# Altium project PCB_Project_ESP32.PrjPcb
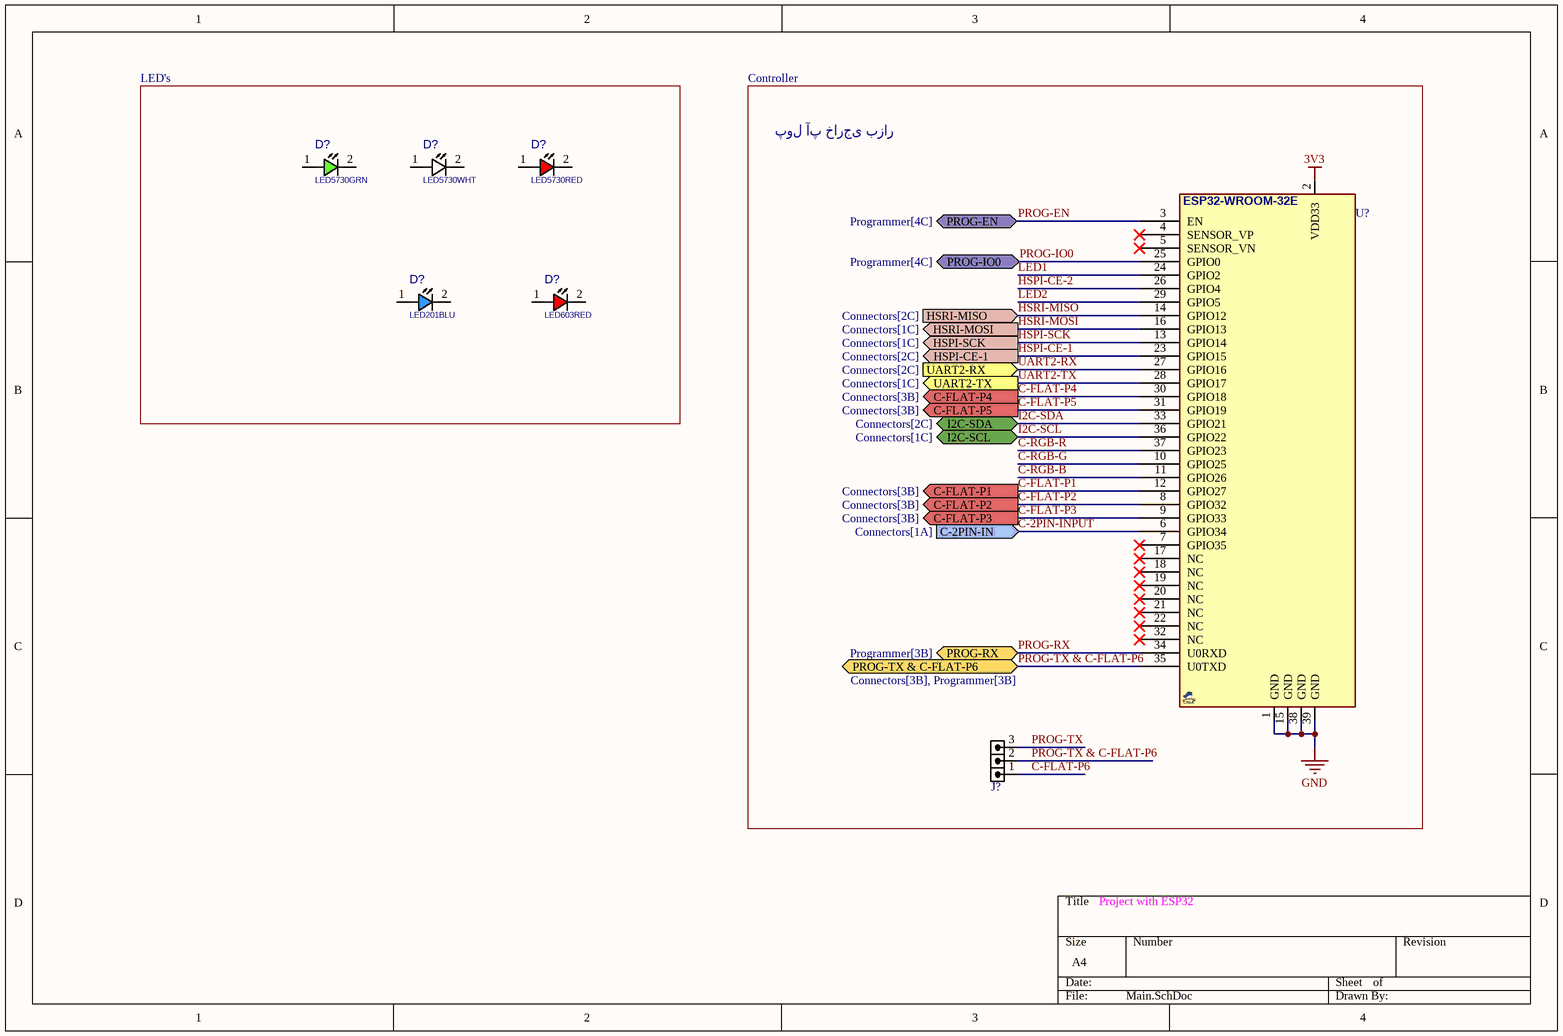
[diagram p0: Main.SchDoc]
5 sheets, 31 parts. Net scope: flat (ports and power ports of the same name join across sheets).
Board file: PCB1.PcbDoc
Sheets:
  Main.SchDoc
  ETH-W5500.SchDoc
  Power.SchDoc
  Programmer.SchDoc
  Connectors.SchDoc

## Sheet Main.SchDoc
size A4; SheetNumber: 1; SheetTotal: 5

### Parts
(Parts that share a designator on the sheet are numbered #1, #2 ... from top to bottom, then left to right.)
D?#1  LED5730GRN  [LED5730]
D?#2  LED5730WHT  [LED5730]
D?#3  LED5730RED  [LED5730]
D?#4  LED201BLU  [LED0201BLU]
D?#5  LED603RED  [LED0603RED]
J?#1  HDRM3  [HDR_M_1X3]  (value not drawn)
U?#1  ESP32-WROOM-32E  [ESP32S]  (value not drawn)

### Blocks framed on the sheet
LED's: D?#1-D?#5
پول آپ خارجی بزار: J?#1 U?#1

### Ports
C-2PIN-IN (in, see Connectors[1A]), C-FLAT-P1 (out, see Connectors[3B]), C-FLAT-P2 (out, see Connectors[3B]), C-FLAT-P3 (out, see Connectors[3B]), C-FLAT-P4 (out, see Connectors[3B]), C-FLAT-P5 (out, see Connectors[3B]), HSPI-CE-1 (out, see Connectors[2C]), HSPI-SCK (out, see Connectors[1C]), HSRI-MISO (in, see Connectors[2C]), HSRI-MOSI (out, see Connectors[1C]), I2C-SCL (bidir, see Connectors[1C]), I2C-SDA (bidir, see Connectors[2C]), PROG-EN (bidir, see Programmer[4C]), PROG-IO0 (bidir, see Programmer[4C]), PROG-RX (bidir, see Programmer[3B]), PROG-TX & C-FLAT-P6 (bidir, see Connectors[3B], Programmer[3B]), UART2-RX (in, see Connectors[2C]), UART2-TX (out, see Connectors[1C])

### Nets
3V3: U?#1.2(VDD33)
GND: U?#1.1(GND) U?#1.15(GND) U?#1.38(GND) U?#1.39(GND)
C-FLAT-P1: U?#1.12(GPIO27) ; port C-FLAT-P1
C-FLAT-P2: U?#1.8(GPIO32) ; port C-FLAT-P2
C-FLAT-P3: U?#1.9(GPIO33) ; port C-FLAT-P3
C-FLAT-P4: U?#1.30(GPIO18) ; port C-FLAT-P4
C-FLAT-P5: U?#1.31(GPIO19) ; port C-FLAT-P5
C-FLAT-P6: J?#1.1
C-RGB-B: U?#1.11(GPIO26)
C-RGB-G: U?#1.10(GPIO25)
C-RGB-R: U?#1.37(GPIO23)
HSPI-CE-1: U?#1.23(GPIO15) ; port HSPI-CE-1
HSPI-CE-2: U?#1.26(GPIO4)
HSPI-SCK: U?#1.13(GPIO14) ; port HSPI-SCK
HSRI-MISO: U?#1.14(GPIO12) ; port HSRI-MISO
HSRI-MOSI: U?#1.16(GPIO13) ; port HSRI-MOSI
I2C-SCL: U?#1.36(GPIO22) ; port I2C-SCL
I2C-SDA: U?#1.33(GPIO21) ; port I2C-SDA
LED1: U?#1.24(GPIO2)
LED2: U?#1.29(GPIO5)
PROG-EN: U?#1.3(EN) ; port PROG-EN
PROG-IO0: U?#1.25(GPIO0) ; port PROG-IO0
PROG-RX: U?#1.34(U0RXD) ; port PROG-RX
PROG-TX: J?#1.3
PROG-TX & C-FLAT-P6: J?#1.2 U?#1.35(U0TXD) ; port PROG-TX & C-FLAT-P6
UART2-RX: U?#1.27(GPIO16) ; port UART2-RX
UART2-TX: U?#1.28(GPIO17) ; port UART2-TX
NetJ-2PIN_1: U?#1.6(GPIO34) ; port C-2PIN-IN

Not connected (* = marked no-connect by the designer): D?#1 1(ANODE) 2(CATHODE); D?#2 1(ANODE) 2(CATHODE); D?#3 1(ANODE) 2(CATHODE); D?#4 1(ANODE) 2(CATHODE); D?#5 1(ANODE) 2(CATHODE); U?#1 4(SENSOR_VP)* 5(SENSOR_VN)* 7(GPIO35)* 17(NC)* 18(NC)* 19(NC)* 20(NC)* 21(NC)* 22(NC)* 32(NC)*

### Notes on the sheet
- Controller
- Project with ESP32
- Labels drawn without touching a wire or pin: C-2PIN-INPUT

### Library data of the parts
D?#1 = LED_SMD_5730GRN: LED, SMD, 5730 GREEN; MANF: CHINA; DESC: DESCRIPTION; MANF_P#: GBG-5730TGKT; PARAM2: 2.2V; ASSEMBLY: ASSEMBLY; PRICE: 50@Javan; VALUE: LED5730GRN
D?#2 = LED_SMD_5730WHT: LED, SMD, 5730 WHITE; DESC: DESCRIPTION; MANF_P#: MANF_PART#; PARAM2: 2.2V; MANF: MANF; ASSEMBLY: ASSEMBLY; PRICE: 50t@Javan; VALUE: LED5730WHT
D?#3 = LED_SMD_5730RED: LED, SMD, 5730 RED; MANF: CHINA; DESC: DESCRIPTION; PARAM2: 2.2V; ASSEMBLY: ASSEMBLY; PRICE: 50@Javan; VALUE: LED5730RED
D?#4 = LED_SMD_0201_BLU: LED, SMD, 0201, BLUE; PARAM: 5mA, 470nm, 110° Angle; MANF: Lumex; DESC: DESCRIPTION; MANF_P#: SML-LX0201USBC-TR; PARAM2: 2.6V, -40~85°C; ASSEMBLY: ASSEMBLY; PRICE: 0.3$; VALUE: LED201BLU
D?#5 = LED_SMD_0603_RED: LED, SMD, 0603, RED; PARAM: 30mA, 640nm; DESC: DESCRIPTION; MANF_P#: MANF_PART#; PARAM2: 1.8~2.5V; MANF: MANF; ASSEMBLY: ASSEMBLY; PRICE: PRICE; VALUE: LED603RED
J?#1 = HDR_M_1X3: CONN, HEADER, Male, pitch: 2.54mm, 3POS; VALUE: HDRM3
U?#1 = ESP32-WROOM-32E: WiFi with Bluetooth 4.0; MANF_P#: ESP32-WROOM-32E; VALUE: ESP32-WROOM-32E

## Sheet ETH-W5500.SchDoc
size A4; SheetNumber: 2; SheetTotal: 5
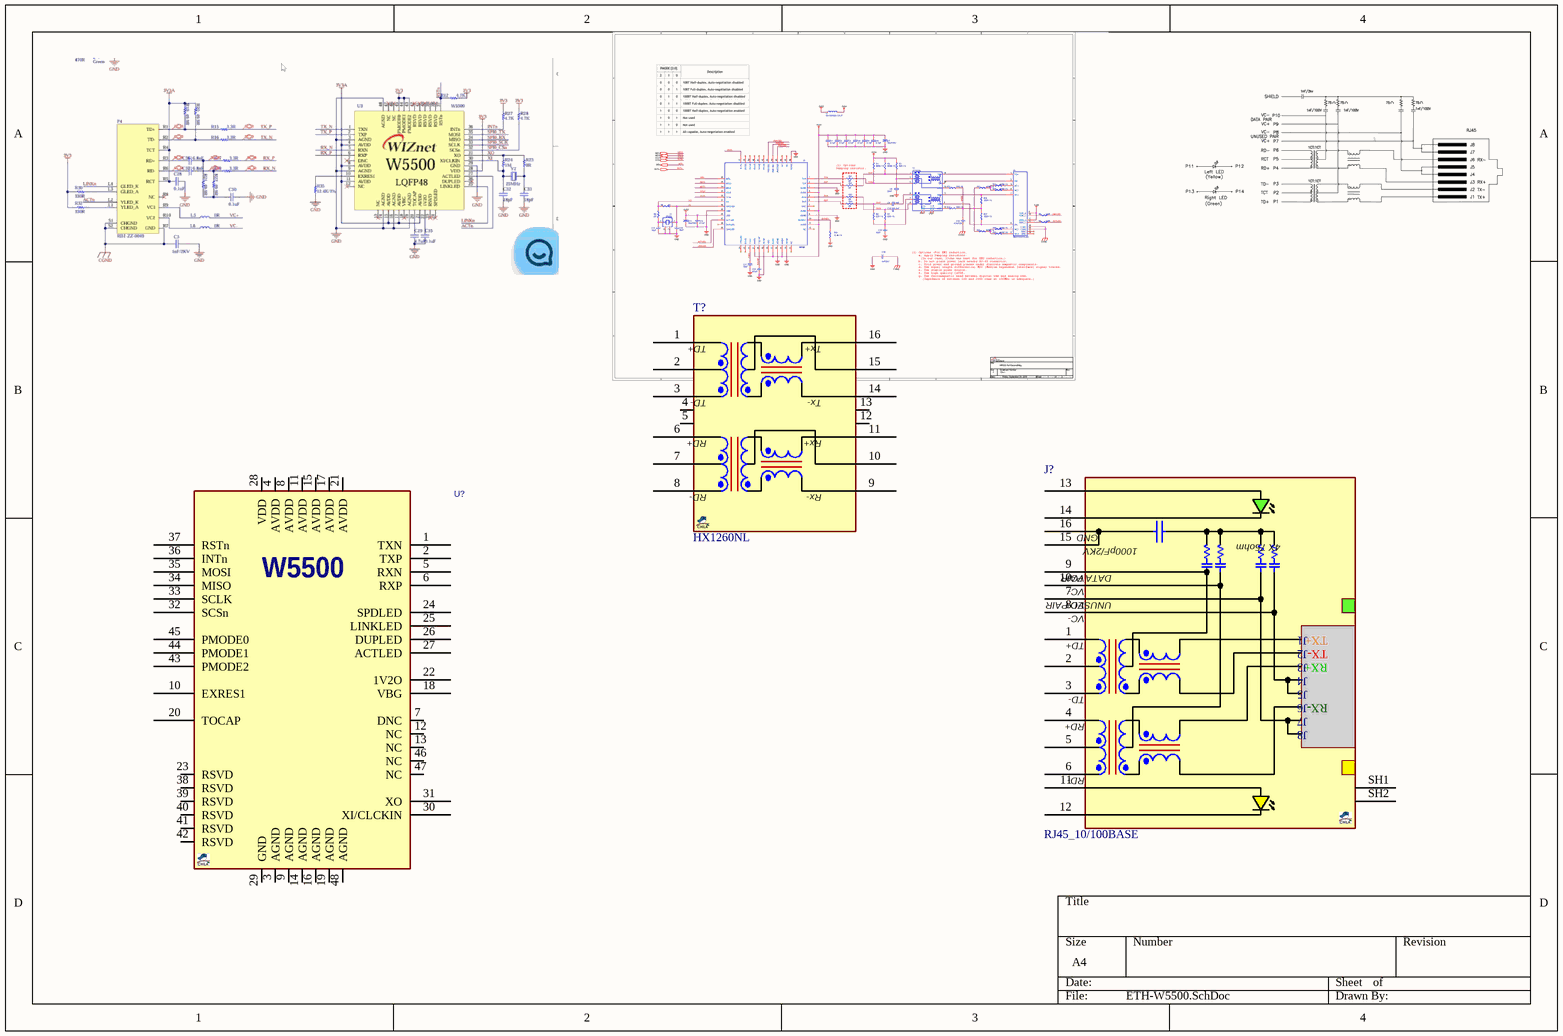
[diagram p1: ETH-W5500.SchDoc]

### Parts
(Parts that share a designator on the sheet are numbered #1, #2 ... from top to bottom, then left to right.)
J?#2  RJ45_10/100BASE  [RJ45_10M_RJ000002]
T?  HX1260NL  [SO_16_7W6H]
U?#2  (no value)  [QFG50_48]

### Nets

Not connected (* = marked no-connect by the designer): J?#2 1(TD+) 2(TCT) 3(TD-) 4(RD+) 5(RCT) 6(RD-) 7(VCU+) 8(VCU-) 9(VCD+) 10(VCD-) 11(YLED+) 12(YLED-) 13(GLED+) 14(GLED-) 15(P15) 16(CHSGND) SH1 SH2; T? 1(TD+) 2(CTD) 3(TD-) 4(NC_1) 5(NC_2) 6(RD+) 7(CRD) 8(RD-) 9(RX-) 10(CRX) 11(RX+) 12(NC_3) 13(NC_4) 14(TX-) 15(CTX) 16(TX+); U?#2 1(TXN) 2(TXP) 3(AGND) 4(AVDD) 5(RXN) 6(RXP) 7(DNC) 8(AVDD) 9(AGND) 10(EXRES1) 11(AVDD) 12(NC) 13(NC) 14(AGND) 15(AVDD) 16(AGND) 17(AVDD) 18(VBG) 19(AGND) 20(TOCAP) 21(AVDD) 22(1V2O) 23(RSVD) 24(SPDLED) 25(LINKLED) 26(DUPLED) 27(ACTLED) 28(VDD) 29(GND) 30(XI/CLCKIN) 31(XO) 32(SCSn) 33(SCLK) 34(MISO) 35(MOSI) 36(INTn) 37(RSTn) 38(RSVD) 39(RSVD) 40(RSVD) 41(RSVD) 42(RSVD) 43(PMODE2) 44(PMODE1) 45(PMODE0) 46(NC) 47(NC) 48(AGND)

### Notes on the sheet
- (in symbol HX1260NL_SO16) Tx+; Tx-; Rx+; Rx-
- (in symbol RJ45_RJ000002) GND; 4X 75ohm; 1000pF/2KV; VC+; DATA PAIR; VC-; UNUSED PAIR; J1; TX+; J2; TX-; J3; RX+; J4; J5; J6; RX-; J7; J8

### Library data of the parts
J?#2 = RJ45_RJ000002: RJ45, 10/100BASE, G/Y LED; MANF: LINK-PP, YCL; MANF_P#: RJ000002; PARAM2: 10/100BASE, G/Y LED; VALUE: RJ45_10/100BASE
T? = HX1260NL_SO16: Transformer, LAN, 100 Base-T , 1CT:1CT, 350uH; MANF: Pulse; PARAM2: 1CT:1CT, 350uH, 0~70°C; MANF_P#: HX1260NL; PARAM: LAN, 100 Base-T; PRICE: 4.5$; VALUE: HX1260NL
U?#2 = W5500_QFP48: Ethernet Controller, 10/100, SPI, DMA; MANF: WIZNET; MANF_P#: W5500

## Sheet Power.SchDoc
size A4; SheetNumber: 3; SheetTotal: 5
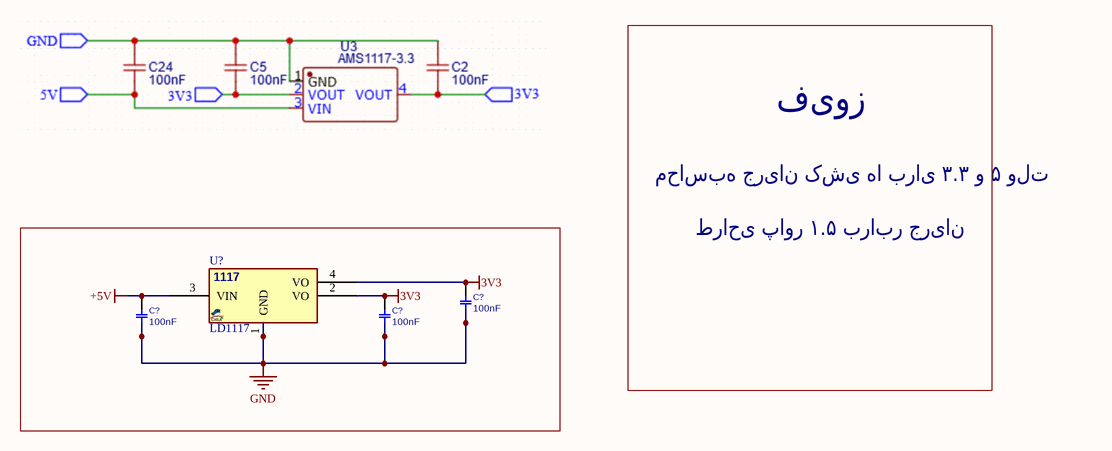
[diagram p2: Power.SchDoc]

### Parts
(Parts that share a designator on the sheet are numbered #1, #2 ... from top to bottom, then left to right.)
C?#1  100nF  [C0402]
C?#2  100nF  [C0402]
C?#3  100nF  [C0402]
U?#3  LD1117  [SOT223_4]

### Nets
3V3: C?#1.1 C?#3.1 U?#3.2(VO) U?#3.4(VO)
+5V: C?#2.1 U?#3.3(VIN)
GND: C?#1.2 C?#2.2 C?#3.2 U?#3.1(GND)

### Notes on the sheet
- فیوز
- محاسبه جریان کشی ها برای ۳.۳ و ۵ ولت
- طراحی پاور ۱.۵ برابر جریان
- (in symbol VREG_1117_SOT223) 1117

### Library data of the parts
C?#1-C?#3 = CAP_SMD_MLCC: CAP, MLCC; PARAM: C0G, 10%; DESC: CAP, MLCC, 1nF, 50V, C0G, 10%, 0402; MANF_P#: MANF_PART#; MANF: Murata; PARAM2: 50V; PRICE: 100= 1$; ASSEMBLY: ASSEMBLY; VALUE: 100nF
U?#3 = VREG_1117_SOT223: REG, Linear, LDO1V, 0.8A, SOT-223; MANF_P#: LD1117, LM1117, AMS1117, TLV1117, REG1117, NCP1117, LT1117, SPX1117; MANF: TI, ON, ST; PARAM2: 1.2/1.5/1.8/2.5/2.85/3.3/5V; PARAM: LDO1V, 0.8A; VALUE: LD1117

## Sheet Programmer.SchDoc
size A4; SheetNumber: 4; SheetTotal: 5
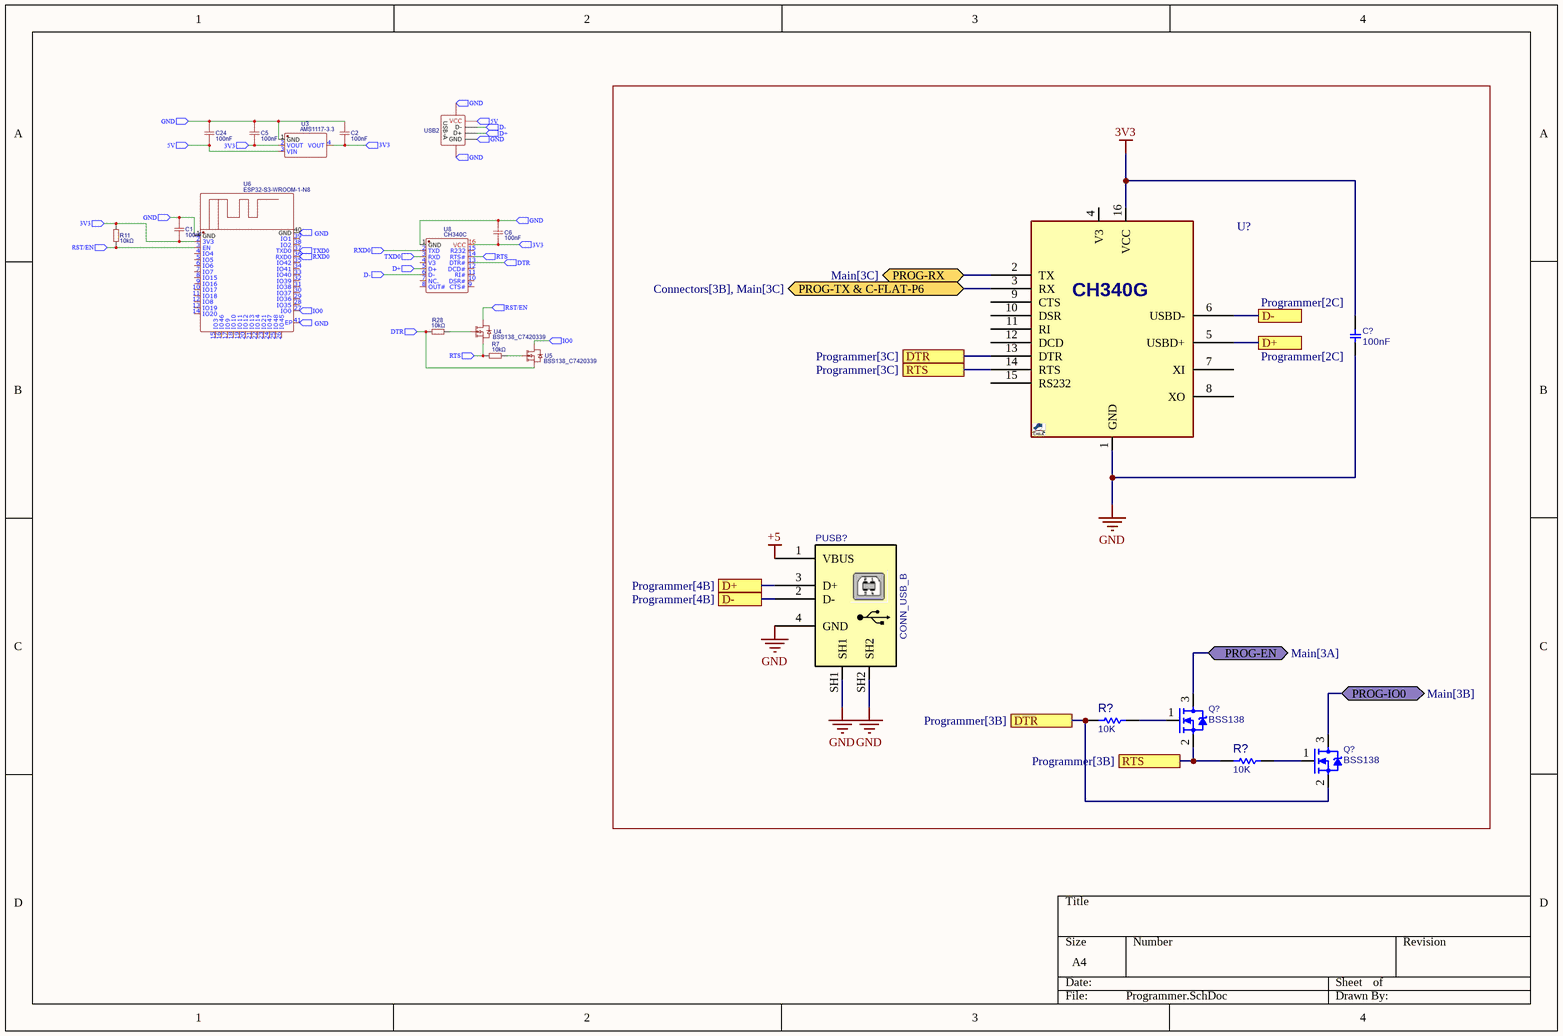
[diagram p3: Programmer.SchDoc]

### Parts
(Parts that share a designator on the sheet are numbered #1, #2 ... from top to bottom, then left to right.)
C?#4  100nF  [C0402]
PUSB?  CONN_USB_B  [USB_B_RA_THD]
Q?#1  BSS138  [SOT23_3]
Q?#2  BSS138  [SOT23_3]
R?#1  10K  [R0402]
R?#2  10K  [R0402]
U?#4  CH340G  [SO_16]  (value not drawn)

### Ports
D+ (see Programmer[2C]), D+ (see Programmer[4B]), D- (see Programmer[2C]), D- (see Programmer[4B]), DTR (see Programmer[3B]), DTR (see Programmer[3C]), PROG-EN (bidir, see Main[3A]), PROG-IO0 (bidir, see Main[3B]), PROG-RX (bidir, see Main[3C]), PROG-TX & C-FLAT-P6 (bidir, see Connectors[3B], Main[3C]), RTS (see Programmer[3B]), RTS (see Programmer[3C])

### Nets
3V3: C?#4.1 U?#4.16(VCC)
+5: PUSB?.1(VBUS)
GND: C?#4.2 PUSB?.4(GND) PUSB?.SH1 PUSB?.SH2 U?#4.1(GND)
PROG-EN: Q?#1.3(DRAIN) ; port PROG-EN
PROG-IO0: Q?#2.3(DRAIN) ; port PROG-IO0
PROG-RX: U?#4.2(TX) ; port PROG-RX
PROG-TX & C-FLAT-P6: U?#4.3(RX) ; port PROG-TX & C-FLAT-P6
NetPUSB?_2: PUSB?.2(D-) U?#4.6(USBD-) ; port D-
NetPUSB?_3: PUSB?.3(D+) U?#4.5(USBD+) ; port D+
NetQ?#1_1: Q?#1.1(GATE) R?#1.2
NetQ?#1_2: Q?#1.2(SOURCE) R?#2.1 U?#4.14(RTS) ; port RTS
NetQ?#2_1: Q?#2.1(GATE) R?#2.2
NetQ?#2_2: Q?#2.2(SOURCE) R?#1.1 U?#4.13(DTR) ; port DTR

Not connected (* = marked no-connect by the designer): U?#4 4(V3) 7(XI) 8(XO) 9(CTS) 10(DSR) 11(RI) 12(DCD) 15(RS232)

### Library data of the parts
C?#4 = CAP_SMD_MLCC: as C?#1 on sheet Power; PRICE: 100= 1$; ASSEMBLY: ASSEMBLY; VALUE: 100nF
PUSB? = CONN_USB_B_RA_THD: CONN, USB, B, R/A, THD; MANF_P#: 292304-1; MANF: TE Connectivity; VALUE: CONN_USB_B
Q?#1 Q?#2 = MOSN_BSS138_SOT23: MOSFET Nchan 50V 200mA; MANF_P#: BSS138-7-F; MANF: Diodes Inc.; DESC: MOSFET Nchan 50V 200mA; PRICE: 0.18; ASSEMBLY: ASSEMBLY; VALUE: BSS138
R?#1 R?#2 = RES_SMD: RESISTOR, SMD; PARAM: -W; DESC: DESCRIPTION; DIST#: MOUSER; PARAM2: 1%; MANF_P#: -; MANF: -; ASSEMBLY: ASSEMBLY; PRICE: 100= 0.5$; VALUE: 10K
U?#4 = CH340G_SOP16: USB-UART; MANF_P#: CH340G; VALUE: CH340G; PACKAGE: SOP-16

## Sheet Connectors.SchDoc
size A3; SheetNumber: 5; SheetTotal: 5
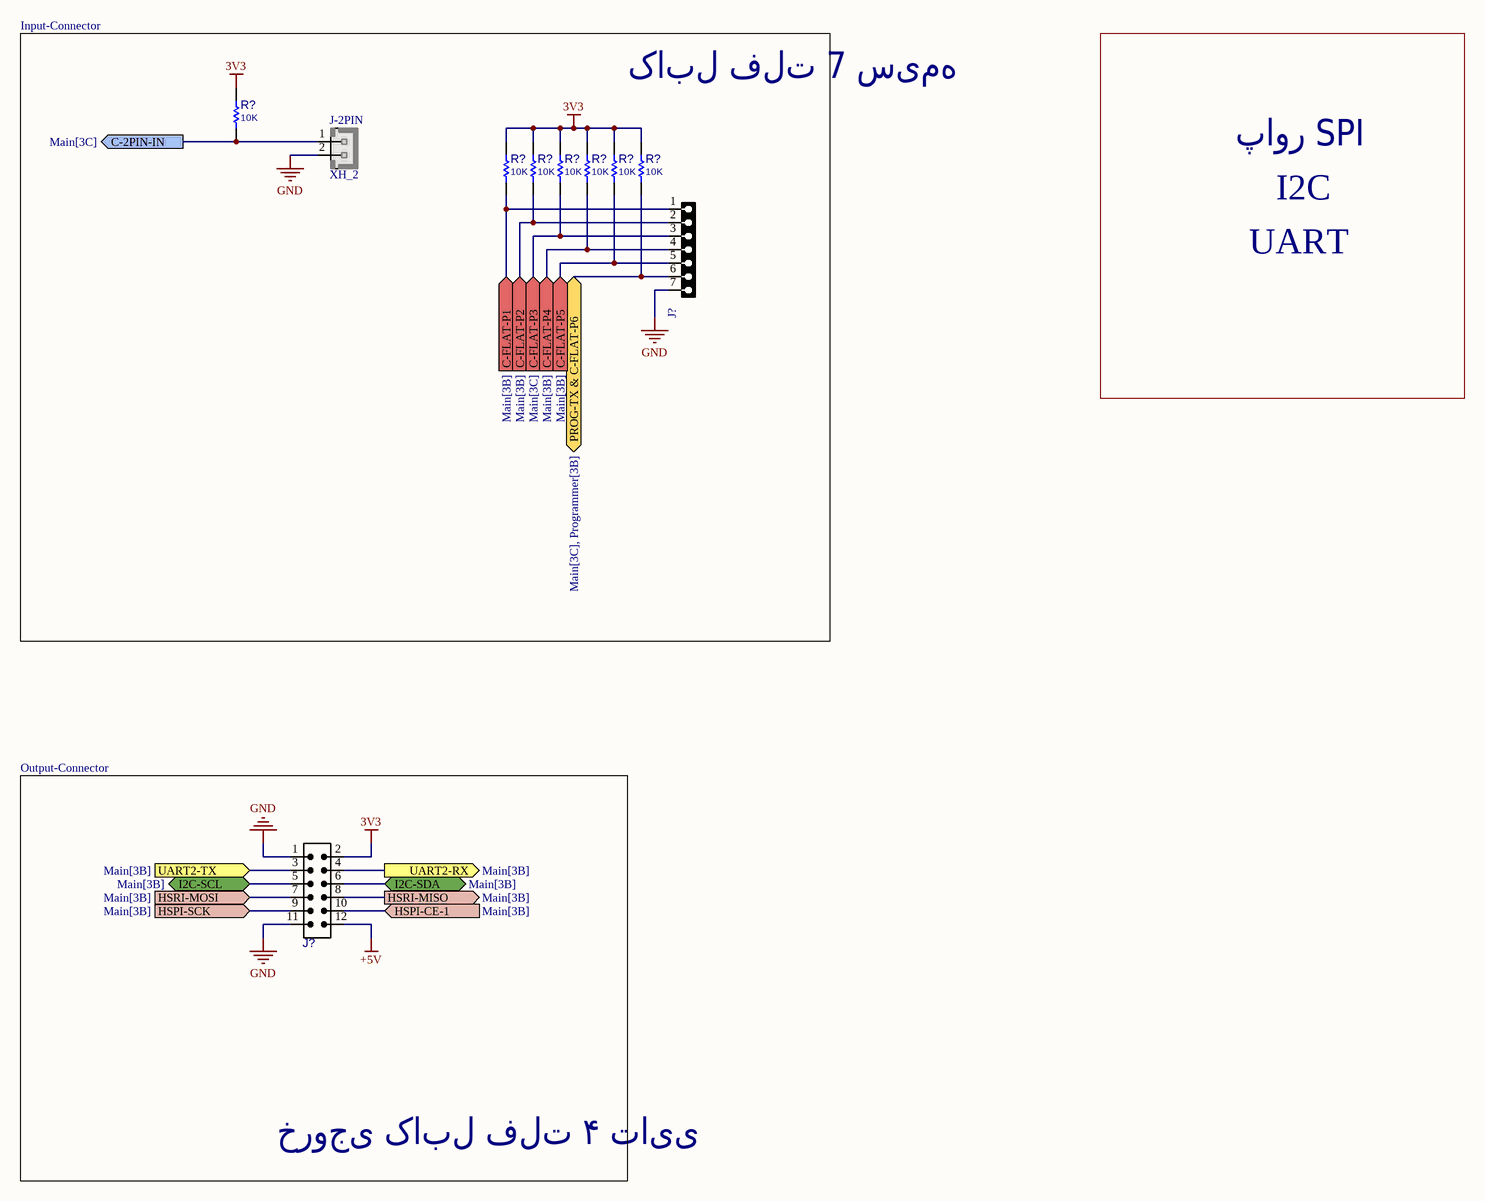
[diagram p4: Connectors.SchDoc]

### Parts
(Parts that share a designator on the sheet are numbered #1, #2 ... from top to bottom, then left to right.)
J-2PIN  XH_2  [XH_2]
J?#3  HDR1X7  [HDRMINI_F_1X7]  (value not drawn)
J?#4  IDC_2X6  [IDC_2X6]  (value not drawn)
R?#3  10K  [R0402]
R?#4  10K  [R0402]
R?#5  10K  [R0402]
R?#6  10K  [R0402]
R?#7  10K  [R0402]
R?#8  10K  [R0402]
R?#9  10K  [R0402]

### Blocks framed on the sheet
کابل فلت 7 سیمه: J-2PIN J?#3 R?#3-R?#9
خروجی کابل فلت ۴ تایی: J?#4

### Ports
C-2PIN-IN (out, see Main[3C]), C-FLAT-P1 (in, see Main[3B]), C-FLAT-P2 (in, see Main[3B]), C-FLAT-P3 (in, see Main[3C]), C-FLAT-P4 (in, see Main[3B]), C-FLAT-P5 (in, see Main[3B]), HSPI-CE-1 (in, see Main[3B]), HSPI-SCK (in, see Main[3B]), HSRI-MISO (out, see Main[3B]), HSRI-MOSI (in, see Main[3B]), I2C-SCL (bidir, see Main[3B]), I2C-SDA (bidir, see Main[3B]), PROG-TX & C-FLAT-P6 (bidir, see Main[3C], Programmer[3B]), UART2-RX (out, see Main[3B]), UART2-TX (in, see Main[3B])

### Nets
3V3: J?#4.2 R?#3.1 R?#4.1 R?#5.1 R?#6.1 R?#7.1 R?#8.1 R?#9.1
+5V: J?#4.12
GND: J-2PIN.2 J?#3.7 J?#4.1 J?#4.11
C-FLAT-P1: J?#3.1 R?#4.2 ; port C-FLAT-P1
C-FLAT-P2: J?#3.2 R?#5.2 ; port C-FLAT-P2
C-FLAT-P3: J?#3.3 R?#6.2 ; port C-FLAT-P3
C-FLAT-P4: J?#3.4 R?#7.2 ; port C-FLAT-P4
C-FLAT-P5: J?#3.5 R?#8.2 ; port C-FLAT-P5
HSPI-CE-1: J?#4.10 ; port HSPI-CE-1
HSPI-SCK: J?#4.9 ; port HSPI-SCK
HSRI-MISO: J?#4.8 ; port HSRI-MISO
HSRI-MOSI: J?#4.7 ; port HSRI-MOSI
I2C-SCL: J?#4.5 ; port I2C-SCL
I2C-SDA: J?#4.6 ; port I2C-SDA
PROG-TX & C-FLAT-P6: J?#3.6 R?#9.2 ; port PROG-TX & C-FLAT-P6
UART2-RX: J?#4.4 ; port UART2-RX
UART2-TX: J?#4.3 ; port UART2-TX
NetJ-2PIN_1: J-2PIN.1 R?#3.2 ; port C-2PIN-IN

### Notes on the sheet
- Input-Connector
- پاور SPI
- UART
- I2C
- Output-Connector

### Library data of the parts
J-2PIN = XH_2: PW10-x-M, JST-BxB-XH-A pitch: 2.5mm, 3A/250v; MANF: JST; MANF_P#: B2B-XH-A; PARAM2: 250v; PARAM: 3.0A; VALUE: XH_2
J?#3 = HDRMINI_F_1X7: CONN, HEADER, Female, pitch: 1.27mm, 7POS; VALUE: HDRMINI_7
J?#4 = IDC_2X6: CONN, IDC, Male, pitch: 2.54mm, 12POS; VALUE: IDC_2X6
R?#3-R?#9 = RES_SMD: as R?#1 on sheet Programmer; MANF_P#: -; MANF: -; ASSEMBLY: ASSEMBLY; PRICE: 100= 0.5$; VALUE: 10K

## Nets that join several sheets
3V3: Main (U?#1.2), Power (C?#1.1 C?#3.1 U?#3.2 U?#3.4), Programmer (C?#4.1 U?#4.16), Connectors (8 pins)
+5V: Power (C?#2.1 U?#3.3), Connectors (J?#4.12)
GND: Main (U?#1.1 U?#1.15 U?#1.38 U?#1.39), Power (C?#1.2 C?#2.2 C?#3.2 U?#3.1), Programmer (5 pins), Connectors (J-2PIN.2 J?#3.7 J?#4.1 J?#4.11)
C-FLAT-P1: Main (U?#1.12), Connectors (J?#3.1 R?#4.2)
C-FLAT-P2: Main (U?#1.8), Connectors (J?#3.2 R?#5.2)
C-FLAT-P3: Main (U?#1.9), Connectors (J?#3.3 R?#6.2)
C-FLAT-P4: Main (U?#1.30), Connectors (J?#3.4 R?#7.2)
C-FLAT-P5: Main (U?#1.31), Connectors (J?#3.5 R?#8.2)
HSPI-CE-1: Main (U?#1.23), Connectors (J?#4.10)
HSPI-SCK: Main (U?#1.13), Connectors (J?#4.9)
HSRI-MISO: Main (U?#1.14), Connectors (J?#4.8)
HSRI-MOSI: Main (U?#1.16), Connectors (J?#4.7)
I2C-SCL: Main (U?#1.36), Connectors (J?#4.5)
I2C-SDA: Main (U?#1.33), Connectors (J?#4.6)
NetJ-2PIN_1: Main (U?#1.6), Connectors (J-2PIN.1 R?#3.2)
PROG-EN: Main (U?#1.3), Programmer (Q?#1.3)
PROG-IO0: Main (U?#1.25), Programmer (Q?#2.3)
PROG-RX: Main (U?#1.34), Programmer (U?#4.2)
PROG-TX & C-FLAT-P6: Main (J?#1.2 U?#1.35), Programmer (U?#4.3), Connectors (J?#3.6 R?#9.2)
UART2-RX: Main (U?#1.27), Connectors (J?#4.4)
UART2-TX: Main (U?#1.28), Connectors (J?#4.3)